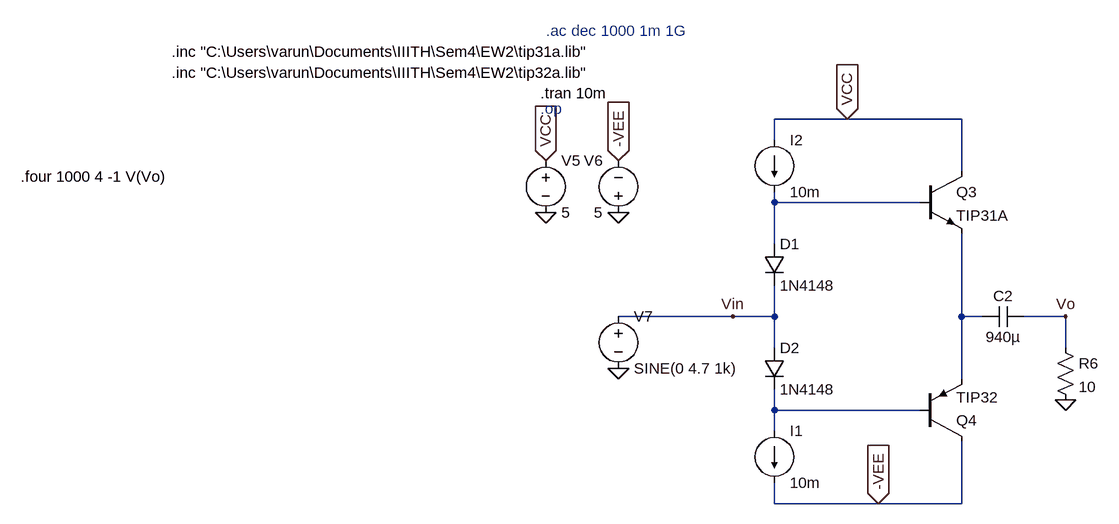
[diagram p0: schematic finalPowerAmp4.asc]
finalPowerAmp4.asc, the LTspice schematic file:
Version 4
SHEET 1 1076 1332
WIRE 688 688 576 688
WIRE 864 688 688 688
WIRE 576 720 576 688
WIRE 864 768 864 688
WIRE 576 816 576 800
WIRE 800 816 576 816
WIRE 576 880 576 816
WIRE 512 992 336 992
WIRE 576 992 576 944
WIRE 576 992 512 992
WIRE 864 992 864 864
WIRE 896 992 864 992
WIRE 1024 992 960 992
WIRE 576 1040 576 992
WIRE 1024 1040 1024 992
WIRE 864 1088 864 992
WIRE 576 1136 576 1104
WIRE 800 1136 576 1136
WIRE 576 1168 576 1136
WIRE 576 1280 576 1248
WIRE 736 1280 576 1280
WIRE 864 1280 864 1184
WIRE 864 1280 736 1280
FLAG 1024 1120 0
FLAG 1024 992 Vo
FLAG 336 832 0
FLAG 224 832 0
FLAG 224 752 VCC
IOPIN 224 752 In
FLAG 336 752 -VEE
IOPIN 336 752 In
FLAG 688 688 VCC
IOPIN 688 688 In
FLAG 736 1280 -VEE
IOPIN 736 1280 In
FLAG 336 1072 0
FLAG 512 992 Vin
SYMBOL diode 560 880 R0
SYMATTR InstName D1
SYMATTR Value 1N4148
SYMBOL diode 560 1040 R0
SYMATTR InstName D2
SYMATTR Value 1N4148
SYMBOL npn 800 768 R0
SYMATTR InstName Q3
SYMATTR Value TIP31A
SYMBOL pnp 800 1184 M180
SYMATTR InstName Q4
SYMATTR Value TIP32
SYMBOL res 1008 1024 R0
SYMATTR InstName R6
SYMATTR Value 10
SYMBOL voltage 224 736 R0
SYMATTR InstName V5
SYMATTR Value 5
SYMBOL voltage 336 848 R180
WINDOW 0 24 96 Left 2
WINDOW 3 24 16 Left 2
SYMATTR InstName V6
SYMATTR Value 5
SYMBOL cap 960 976 R90
WINDOW 0 0 32 VBottom 2
WINDOW 3 32 32 VTop 2
SYMATTR InstName C2
SYMATTR Value 940µ
SYMBOL voltage 336 976 R0
WINDOW 123 24 40 Left 2
WINDOW 39 0 0 Left 0
SYMATTR InstName V7
SYMATTR Value SINE(0 4.7 1k)
SYMBOL current 576 1168 R0
SYMATTR InstName I1
SYMATTR Value 10m
SYMBOL current 576 720 R0
SYMATTR InstName I2
SYMATTR Value 10m
TEXT 216 648 Left 2 !.tran 10m
TEXT -352 616 Left 2 !.inc "C:\\Users\\varun\\Documents\\IIITH\\Sem4\\EW2\\tip32a.lib"
TEXT -352 584 Left 2 !.inc "C:\\Users\\varun\\Documents\\IIITH\\Sem4\\EW2\\tip31a.lib"
TEXT 224 552 Left 2 ;.ac dec 1000 1m 1G
TEXT 216 672 Left 2 ;.op
TEXT -584 776 Left 2 !.four 1000 4 -1 V(Vo)

The netlist it stands for:
* finalPowerAmp4.asc
D1 N001 Vin 1N4148
D2 Vin N003 1N4148
Q3 VCC N001 N002 0 TIP31A
Q4 -VEE N003 N002 0 TIP32
R6 Vo 0 10
V5 VCC 0 5
V6 0 -VEE 5
C2 Vo N002 940µ
V7 Vin 0 SINE(0 4.7 1k)
I1 N003 -VEE 10m
I2 VCC N001 10m
.model D D
.lib standard.dio
.model NPN NPN
.model PNP PNP
.lib standard.bjt
.tran 10m
.inc "C:\Users\varun\Documents\IIITH\Sem4\EW2\tip32a.lib"
.inc "C:\Users\varun\Documents\IIITH\Sem4\EW2\tip31a.lib"
* .ac dec 1000 1m 1G
* .op
.four 1000 4 -1 V(Vo)
.backanno
.end